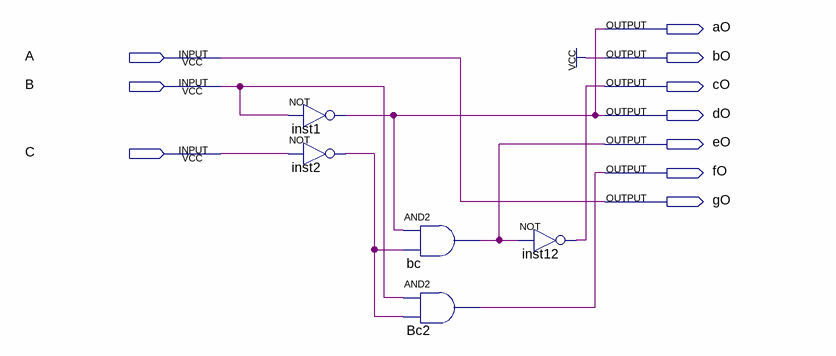
[diagram p0: schematic sheet]
// Quartus schematic 7segment.bdf as structural Verilog: 5 symbols, 10 pins
module \7segment  (
  input  A,
  input  B,
  input  C,
  output aO,
  output bO,
  output cO,
  output dO,
  output eO,
  output fO,
  output gO
);

  wire inst2_out;

  not inst1 (aO, B);
  not inst2 (inst2_out, C);
  and bc (eO, aO, inst2_out);
  and Bc2 (fO, B, inst2_out);
  not inst12 (cO, eO);

  assign bO = 1'b1;
  assign dO = aO;
  assign gO = A;
endmodule
